# EAGLE design Mikrobus-Proto-18 (EAGLE 6.6.0)
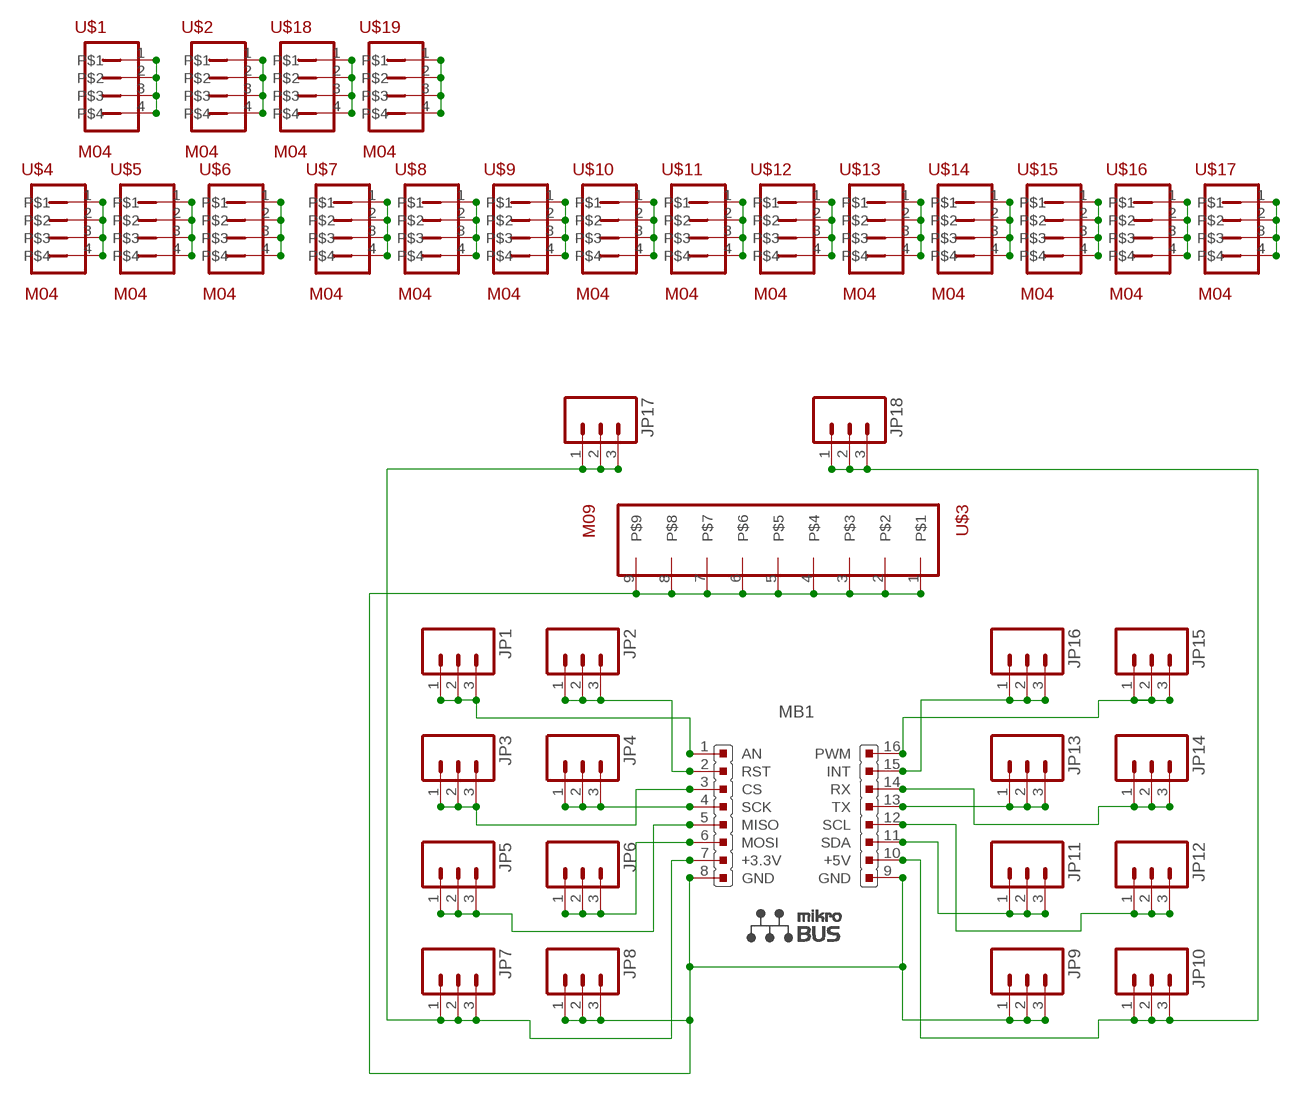
[diagram p0: schematic, sheet 1]

## Parts
JP1  M03PTH  [1X03]
JP2  M03PTH  [1X03]
JP3  M03PTH  [1X03]
JP4  M03PTH  [1X03]
JP5  M03PTH  [1X03]
JP6  M03PTH  [1X03]
JP7  M03PTH  [1X03]
JP8  M03PTH  [1X03]
JP9  M03PTH  [1X03]
JP10  M03PTH  [1X03]
JP11  M03PTH  [1X03]
JP12  M03PTH  [1X03]
JP13  M03PTH  [1X03]
JP14  M03PTH  [1X03]
JP15  M03PTH  [1X03]
JP16  M03PTH  [1X03]
JP17  M03PTH  [1X03]
JP18  M03PTH  [1X03]
MB1  MIKROBUS  [MIKROBUS]
U$1  M04  [1X04]
U$2  M04  [1X04]
U$3  M09  [1X09]
U$4  M04  [1X04]
U$5  M04  [1X04]
U$6  M04  [1X04]
U$7  M04  [1X04]
U$8  M04  [1X04]
U$9  M04  [1X04]
U$10  M04  [1X04]
U$11  M04  [1X04]
U$12  M04  [1X04]
U$13  M04  [1X04]
U$14  M04  [1X04]
U$15  M04  [1X04]
U$16  M04  [1X04]
U$17  M04  [1X04]
U$18  M04  [1X04]
U$19  M04  [1X04]

## Nets
+3.3V: JP7.1 JP7.2 JP7.3 JP17.1 JP17.2 JP17.3 MB1.7(+3.3V)
+5V: JP10.1 JP10.2 JP10.3 JP18.1 JP18.2 JP18.3 MB1.10(+5V)
AN: JP1.1 JP1.2 JP1.3 MB1.1(AN)
CS: JP3.1 JP3.2 JP3.3 MB1.3(CS)
GND: JP8.1 JP8.2 JP8.3 JP9.1 JP9.2 JP9.3 MB1.8(GND) MB1.9(GND) U$3.1 U$3.2 U$3.3 U$3.4 U$3.5 U$3.6 U$3.7 U$3.8 U$3.9
INT: JP16.1 JP16.2 JP16.3 MB1.15(INT)
L1: U$18.1 U$18.2 U$18.3 U$18.4
L2: U$1.1 U$1.2 U$1.3 U$1.4
L3: U$16.1 U$16.2 U$16.3 U$16.4
L4: U$14.1 U$14.2 U$14.3 U$14.4
L5: U$12.1 U$12.2 U$12.3 U$12.4
L6: U$10.1 U$10.2 U$10.3 U$10.4
L7: U$8.1 U$8.2 U$8.3 U$8.4
L8: U$6.1 U$6.2 U$6.3 U$6.4
L9: U$4.1 U$4.2 U$4.3 U$4.4
MISO: JP5.1 JP5.2 JP5.3 MB1.5(MISO)
MOSI: JP6.1 JP6.2 JP6.3 MB1.6(MOSI)
PWM: JP15.1 JP15.2 JP15.3 MB1.16(PWM)
R1: U$19.1 U$19.2 U$19.3 U$19.4
R2: U$2.1 U$2.2 U$2.3 U$2.4
R3: U$17.1 U$17.2 U$17.3 U$17.4
R4: U$15.1 U$15.2 U$15.3 U$15.4
R5: U$13.1 U$13.2 U$13.3 U$13.4
R6: U$11.1 U$11.2 U$11.3 U$11.4
R7: U$9.1 U$9.2 U$9.3 U$9.4
R8: U$7.1 U$7.2 U$7.3 U$7.4
R9: U$5.1 U$5.2 U$5.3 U$5.4
RST: JP2.1 JP2.2 JP2.3 MB1.2(RST)
RX: JP14.1 JP14.2 JP14.3 MB1.14(RX)
SCK: JP4.1 JP4.2 JP4.3 MB1.4(SCK)
SCL: JP12.1 JP12.2 JP12.3 MB1.12(SCL)
SDA: JP11.1 JP11.2 JP11.3 MB1.11(SDA)
TX: JP13.1 JP13.2 JP13.3 MB1.13(TX)

## Library data of the parts
JP1-JP18 = KS Proto:M03: Header 3 Standard 3-pin 0.1" header. Use with straight break away headers (SKU : PRT-00116), right angle break away headers (PRT-00553), swiss pins (PRT-00743), machine pins (PRT-00117), and female headers (PRT-00115). Molex polarized connector foot print use with SKU : PRT-08232 with associated crimp pins and housings.
MB1 = KS Proto:MIKROBUS: MikroBUS Source: MikroBUS specification <http://www.mikroe.com/downloads/get/1737/mikrobus_specification.pdf> MikroBUS <http://www.mikroe.com/mikrobus/>
U$1 U$2 U$4-U$19 = KS Proto:M04
U$3 = KS Proto:M09

## Board
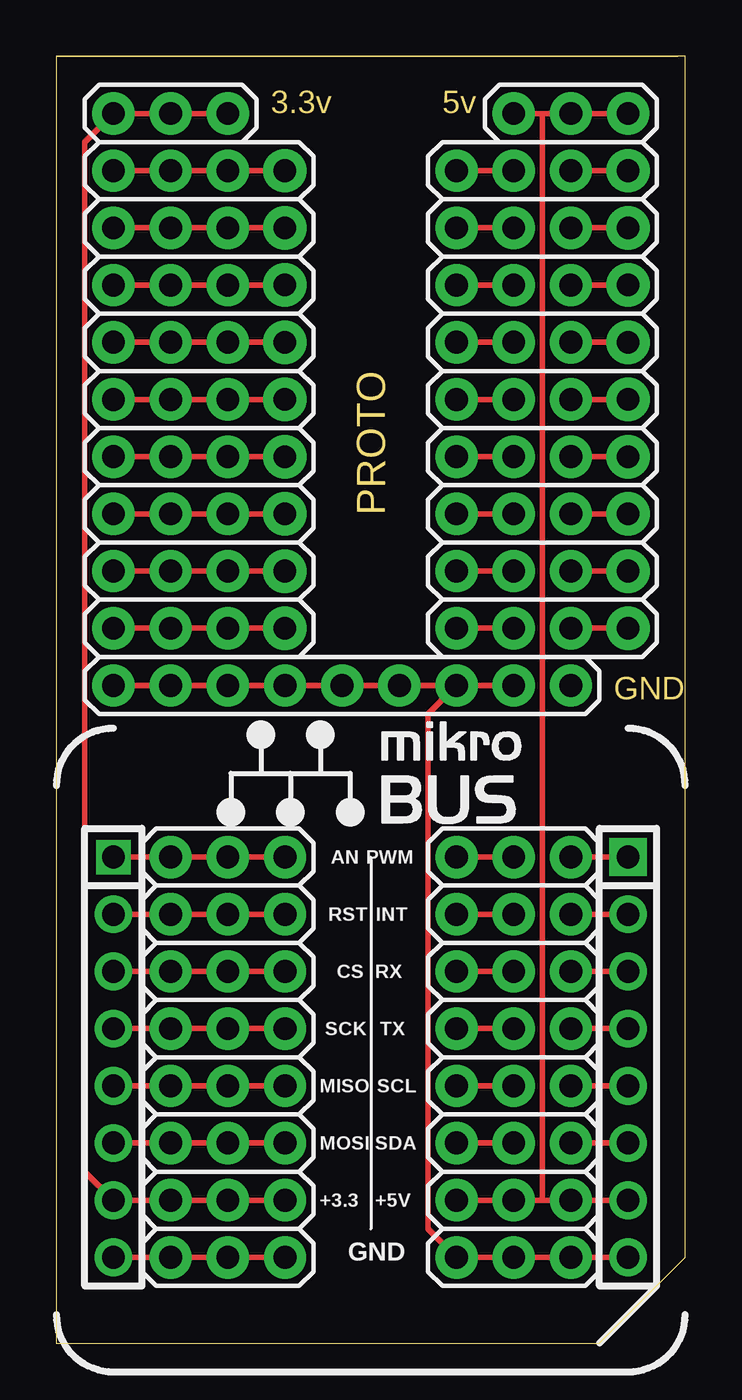
[diagram p1: board, top side]
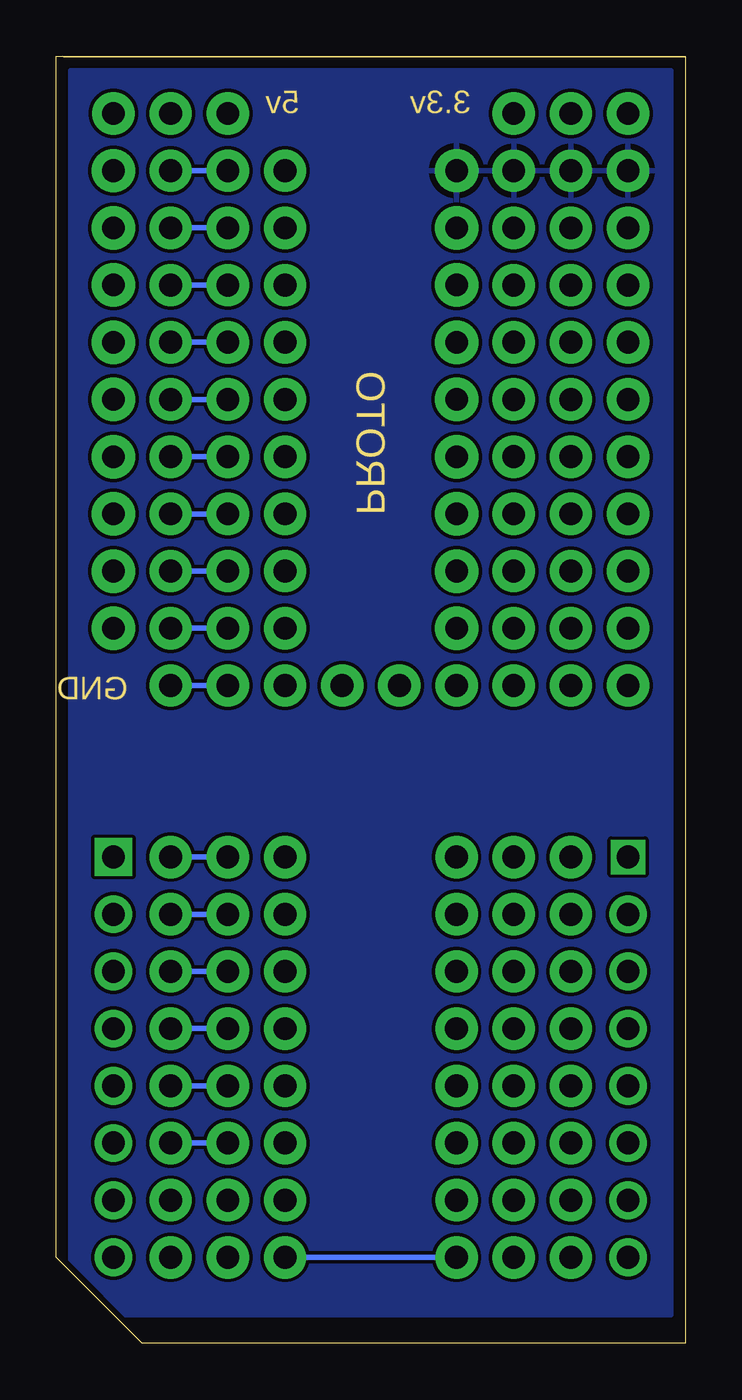
[diagram p2: board, bottom side, seen from below]

Size 27.94 x 57.15 mm. Coordinates in mm from the lower left corner, seen from the top.
Outline: 27.61,57.14 0,57.14
Outline: 0,57.14 0,0 24.13,0 27.94,3.81 27.94,57.15 0,57.15 0,57.14
Copper layers (1*16): Top 0.035mm / dielectric 1.5mm / Bottom 0.035mm
Design rules "ITEADstudio_DRC": minimum track width 6mil, minimum drill 12mil, track to track 6mil, track to pad 6mil, pad to pad 6mil, via to via 6mil, smd to smd 0mil, copper to edge 10mil, drill to drill 10mil, minimum pad ring 10mil, minimum via ring 6mil, stop-mask expansion 2mil, vias tented up to drill 100mil, thermal gap 10mil

### Footprints (pad centres in the part's own frame; a part is rotated, then mirrored left to right if it is on the bottom)
1X03 = drill 1.016 pad 1.88: 1 0,0; 2 2.54,0; 3 5.08,0
MIKROBUS = drill 1.016 square: 1 -11.43,7.62 | drill 1.016 pad 1.676: 2 -11.43,5.08; 3 -11.43,2.54; 4 -11.43,0; 5 -11.43,-2.54; 6 -11.43,-5.08; 7 -11.43,-7.62; 8 -11.43,-10.16; 9 11.43,-10.16; 10 11.43,-7.62; 11 11.43,-5.08; 12 11.43,-2.54; 13 11.43,0; 14 11.43,2.54; 15 11.43,5.08 | drill 1.016 pad 1.676 square: 16 11.43,7.62
1X04 = drill 1.016 pad 1.88: 1 0,0; 2 2.54,0; 3 5.08,0 | drill 1 pad 1.93: 4 7.62,0
1X09 = drill 1.016 pad 1.88: 1 0,0; 2 2.54,0; 3 5.08,0; 4 7.62,0; 5 10.16,0; 6 12.7,0; 7 15.24,0; 8 17.78,0; 9 20.32,0

### Placement (x,y rotation side)
JP1  5.08,21.59 0 top
JP2  5.08,19.05 0 top
JP3  5.08,16.51 0 top
JP4  5.08,13.97 0 top
JP5  5.08,11.43 0 top
JP6  5.08,8.89 0 top
JP7  5.08,6.35 0 top
JP8  5.08,3.81 0 top
JP9  17.78,3.81 0 top
JP10  17.78,6.35 0 top
JP11  17.78,8.89 0 top
JP12  17.78,11.43 0 top
JP13  17.78,13.97 0 top
JP14  17.78,16.51 0 top
JP15  17.78,21.59 0 top
JP16  17.78,19.05 0 top
JP17  2.54,54.61 0 top
JP18  20.32,54.61 0 top
MB1  13.97,13.97 0 top
U$1  2.54,49.53 0 top
U$2  17.78,49.53 0 top
U$3  2.54,29.21 0 top
U$4  2.54,31.75 0 top
U$5  17.78,31.75 0 top
U$6  2.54,34.29 0 top
U$7  17.78,34.29 0 top
U$8  2.54,36.83 0 top
U$9  17.78,36.83 0 top
U$10  2.54,39.37 0 top
U$11  17.78,39.37 0 top
U$12  2.54,41.91 0 top
U$13  17.78,41.91 0 top
U$14  2.54,44.45 0 top
U$15  17.78,44.45 0 top
U$16  2.54,46.99 0 top
U$17  17.78,46.99 0 top
U$18  2.54,52.07 0 top
U$19  17.78,52.07 0 top

### Tracks (layer width: path | path; a pad name or v marks a point on that pad's centre or on a via)
+3.3V
  Top 0.254: JP17.3 JP17.2 JP17.1 1.27,53.34 1.27,7.62 MB1.7 JP7.1 JP7.2 JP7.3
+5V
  Top 0.254: 21.59,54.61 JP18.2 JP18.3 | 21.59,54.61 JP18.1 | MB1.10 JP10.3 21.59,6.35 | JP10.1 JP10.2 21.59,6.35 | 21.59,6.35 21.59,54.61
AN
  Top 0.254: MB1.1 JP1.1 JP1.2 JP1.3
CS
  Top 0.254: MB1.3 JP3.1 JP3.2 JP3.3
GND
  Top 0.254: U$3.1 U$3.2 U$3.3 U$3.4 U$3.5 U$3.6 U$3.7 | U$3.7 U$3.8 | MB1.8 JP8.1 JP8.2 JP8.3 | MB1.9 JP9.3 JP9.2 JP9.1 16.51,5.08 16.51,27.94 U$3.7
  Bottom 0.254: U$3.8 U$3.9 | JP9.1 JP8.3
INT
  Top 0.254: JP16.3 MB1.15 | JP16.2 JP16.1
  Bottom 0.254: JP16.2 JP16.3
L1
  Top 0.254: U$18.1 U$18.2 U$18.3 U$18.4
  pour Bottom: 0.64,56.51 27.3,56.51 27.3,3.18 25.4,1.27 0.64,1.27
L2
  Top 0.254: U$1.1 U$1.2 U$1.3 U$1.4
L3
  Top 0.254: U$16.1 U$16.2 U$16.3 U$16.4
L4
  Top 0.254: U$14.1 U$14.2 U$14.3 U$14.4
L5
  Top 0.254: U$12.1 U$12.2 U$12.3 U$12.4
L6
  Top 0.254: U$10.1 U$10.2 U$10.3 U$10.4
L7
  Top 0.254: U$8.1 U$8.2 U$8.3 U$8.4
L8
  Top 0.254: U$6.1 U$6.2 U$6.3 U$6.4
L9
  Top 0.254: U$4.1 U$4.2 U$4.3 U$4.4
MISO
  Top 0.254: MB1.5 JP5.1 JP5.2 JP5.3
MOSI
  Top 0.254: MB1.6 JP6.1 JP6.2 JP6.3
PWM
  Top 0.254: JP15.3 MB1.16 | JP15.2 JP15.1
  Bottom 0.254: JP15.2 JP15.3
R1
  Top 0.254: U$19.2 U$19.1 | U$19.4 U$19.3
  Bottom 0.254: U$19.3 U$19.2
R2
  Top 0.254: U$2.2 U$2.1 | U$2.4 U$2.3
  Bottom 0.254: U$2.3 U$2.2
R3
  Top 0.254: U$17.2 U$17.1 | U$17.4 U$17.3
  Bottom 0.254: U$17.3 U$17.2
R4
  Top 0.254: U$15.2 U$15.1 | U$15.4 U$15.3
  Bottom 0.254: U$15.3 U$15.2
R5
  Top 0.254: U$13.2 U$13.1 | U$13.4 U$13.3
  Bottom 0.254: U$13.3 U$13.2
R6
  Top 0.254: U$11.2 U$11.1 | U$11.4 U$11.3
  Bottom 0.254: U$11.3 U$11.2
R7
  Top 0.254: U$9.2 U$9.1 | U$9.4 U$9.3
  Bottom 0.254: U$9.3 U$9.2
R8
  Top 0.254: U$7.2 U$7.1 | U$7.4 U$7.3
  Bottom 0.254: U$7.3 U$7.2
R9
  Top 0.254: U$5.2 U$5.1 | U$5.4 U$5.3
  Bottom 0.254: U$5.3 U$5.2
RST
  Top 0.254: MB1.2 JP2.1 JP2.2 JP2.3
RX
  Top 0.254: JP14.3 MB1.14 | JP14.2 JP14.1
  Bottom 0.254: JP14.2 JP14.3
SCK
  Top 0.254: MB1.4 JP4.1 JP4.2 JP4.3
SCL
  Top 0.254: JP12.3 MB1.12 | JP12.2 JP12.1
  Bottom 0.254: JP12.2 JP12.3
SDA
  Top 0.254: JP11.3 MB1.11 | JP11.2 JP11.1
  Bottom 0.254: JP11.2 JP11.3
TX
  Top 0.254: JP13.3 MB1.13 | JP13.2 JP13.1
  Bottom 0.254: JP13.2 JP13.3

### Text on the board
Dimension: 3.3v | 5v | PROTO | GND